# Altium schematic sheet prijemnik_sematik.SchDoc
size A3; SheetNumber: 1; SheetTotal: 1
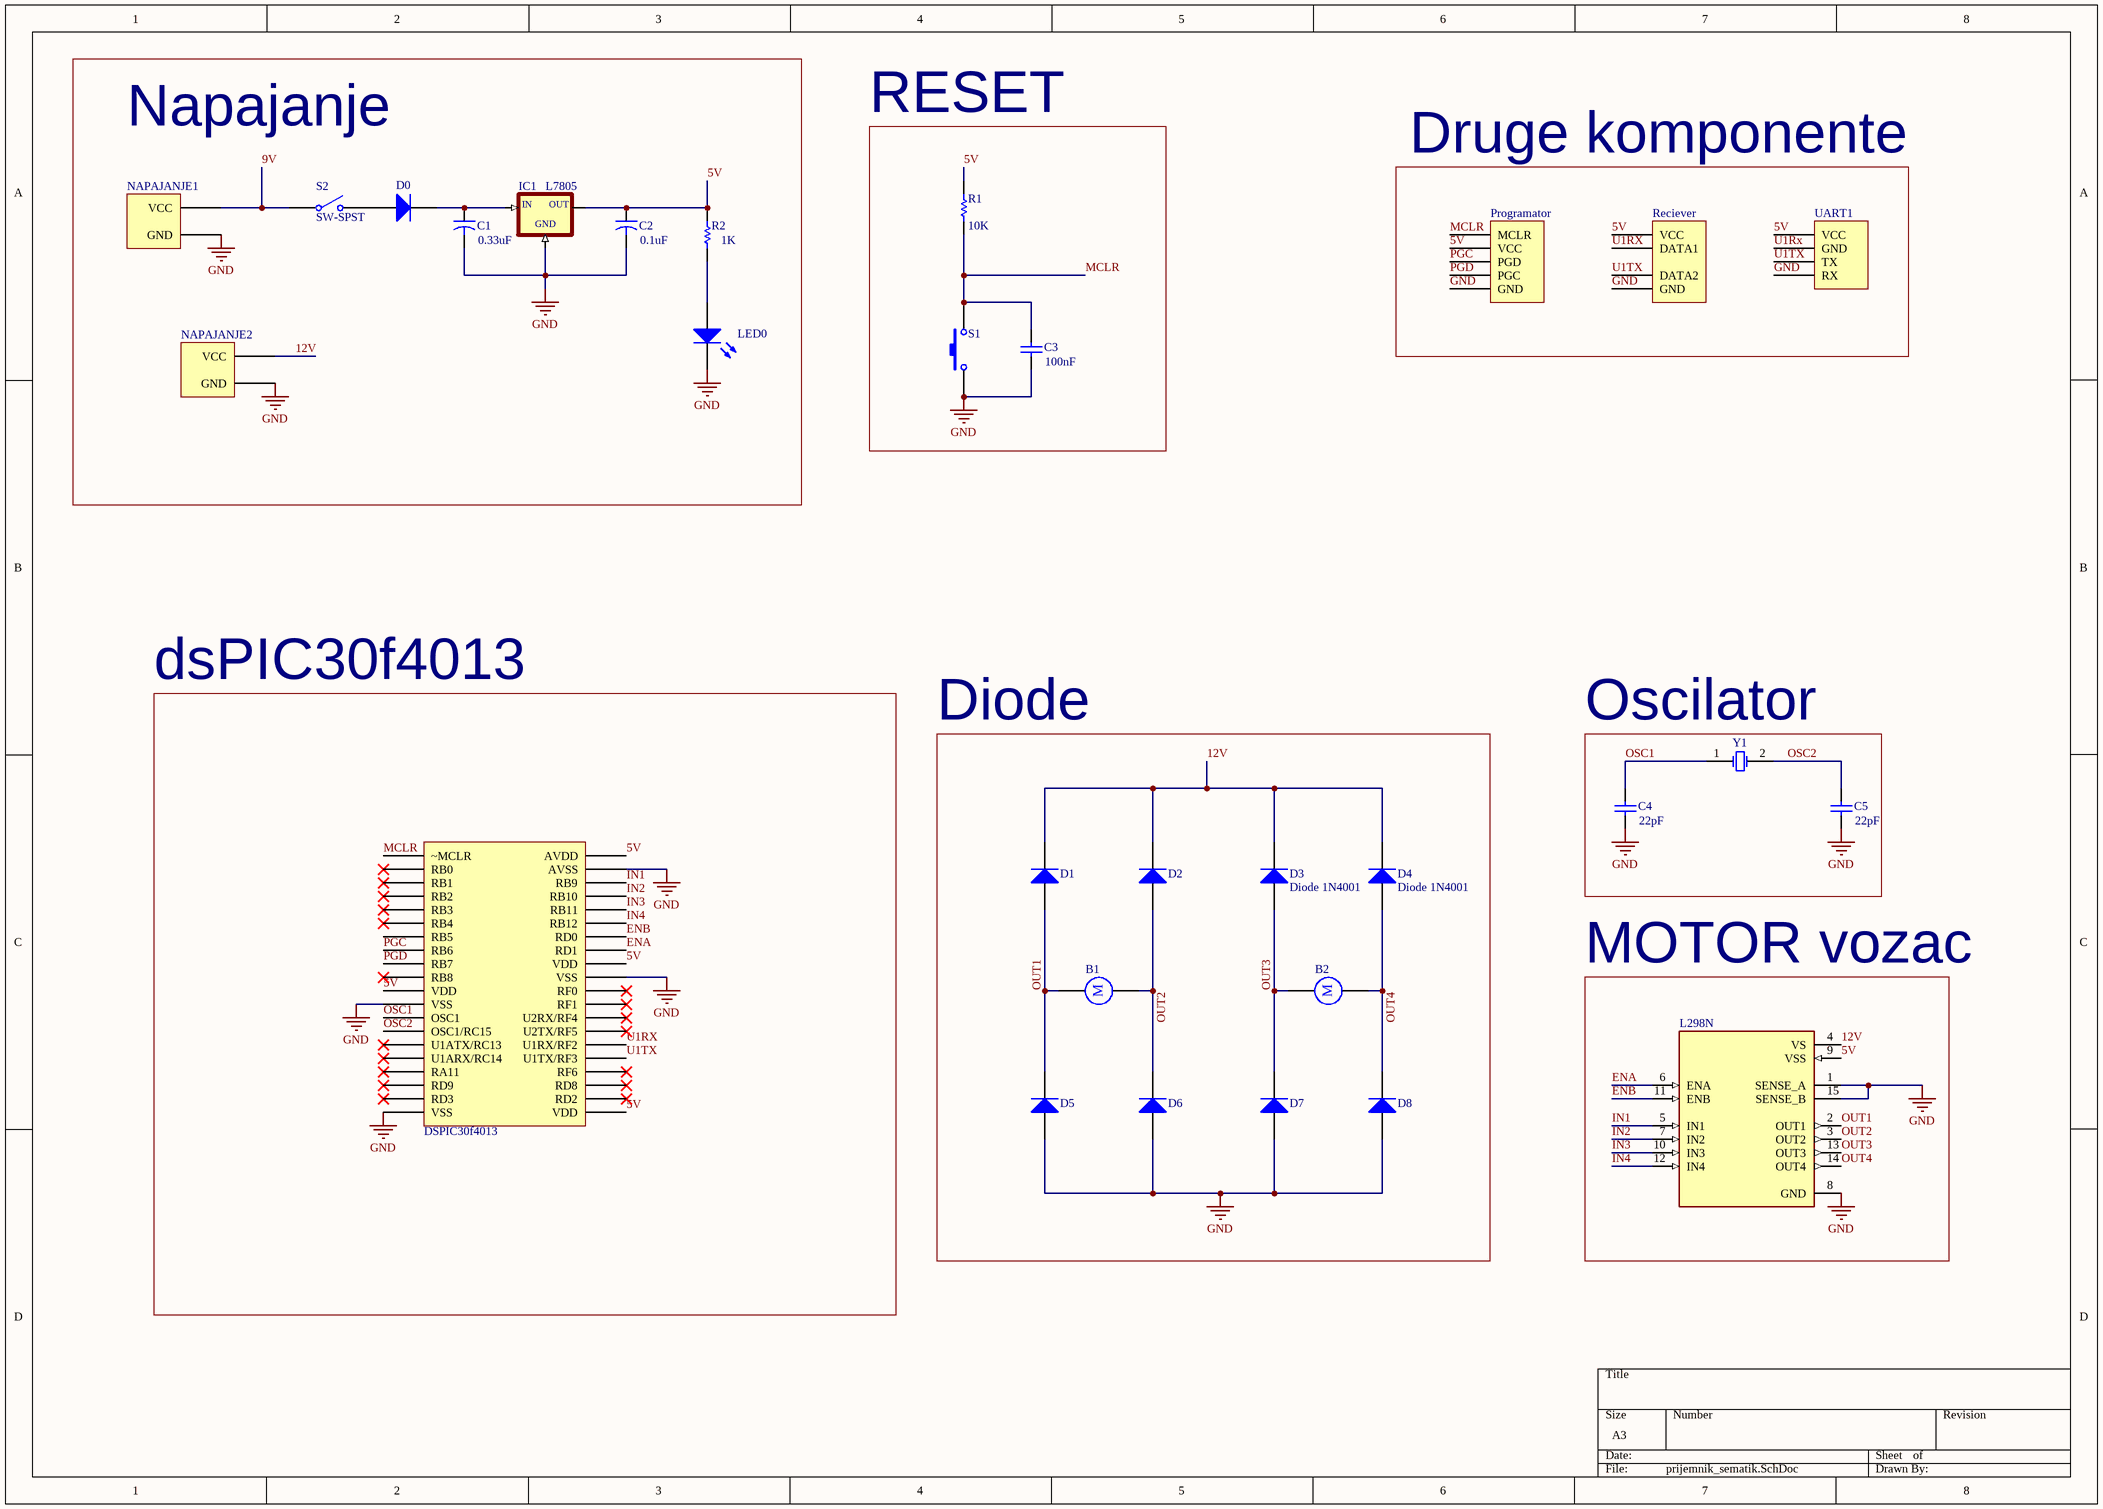
[diagram p0: prijemnik_sematik.SchDoc]

## Parts
B1  Motor  [RB5-10.5]  (value not drawn)
B2  Motor  [RB5-10.5]  (value not drawn)
C1  value 0.33uF  [CAPR5-4X5]  (hidden comment: Cap2)
C2  value 0.1uF  [CAPR5-4X5]  (hidden comment: Cap2)
C3  value 100nF  [RAD-0.3]  (hidden comment: Cap)
C4  value 22pF  [RAD-0.3]  (hidden comment: Cap)
C5  value 22pF  [RAD-0.3]  (hidden comment: Cap)
D0  Diode 1N4007  [DO-41]  (value not drawn)
D1  Diode 1N4001  [DO-41]  (value not drawn)
D2  Diode 1N4001  [DO-41]  (value not drawn)
D3  Diode 1N4001  [DO-41]
D4  Diode 1N4001  [DO-41]
D5  Diode 1N4001  [DO-41]  (value not drawn)
D6  Diode 1N4001  [DO-41]  (value not drawn)
D7  Diode 1N4001  [DO-41]  (value not drawn)
D8  Diode 1N4001  [DO-41]  (value not drawn)
DSPIC30f4013  DSPIC30f4013  [DIP254P1524X635-40]  (value not drawn)
IC1  L7805  [78XXS]
L298N  L298N  [TO127P2020X500X2100-15]  (value not drawn)
LED0  LED0  [LED-0]  (value not drawn)
NAPAJANJE1  NAPAJANJE  [HDR1X2]  (value not drawn)
NAPAJANJE2  NAPAJANJE  [HDR1X2]  (value not drawn)
Programator  Programator  [HDR1X5]  (value not drawn)
R1  value 10K  [AXIAL-0.3]  (hidden comment: Res1)
R2  value 1K  [AXIAL-0.3]  (hidden comment: Res1)
Reciever  Reciever  [HDR1X4]  (value not drawn)
S1  SW-PB  [SPST-2]  (value not drawn)
S2  SW-SPST  [SPST-2]
UART1  UART1  [HDR1X4]  (value not drawn)
Y1  XTAL  [R38]  (value not drawn)

## Blocks framed on the sheet
Napajanje: C1 C2 D0 IC1 LED0 NAPAJANJE1 NAPAJANJE2 R2 S2
RESET: C3 R1 S1
Druge komponente: Programator Reciever UART1
dsPIC30f4013: DSPIC30f4013
Diode: B1 B2 D1-D8
Oscilator: C4 C5 Y1
MOTOR vozac: L298N

## Nets
GND: C1.2 C2.2 C3.1 C4.1 C5.1 D5.1(A) D6.1(A) D7.1(A) D8.1(A) DSPIC30f4013.12(VSS) DSPIC30f4013.20(VSS) DSPIC30f4013.31(VSS) DSPIC30f4013.39(AVSS) IC1.GND L298N.1(SENSE_A) L298N.8(GND) L298N.15(SENSE_B) LED0.2(K) NAPAJANJE1.GND NAPAJANJE2.GND Programator.28(GND) Reciever.33(GND) S1.1 UART1.27(RX)
5V: C2.1 DSPIC30f4013.11(VDD) DSPIC30f4013.21(VDD) DSPIC30f4013.32(VDD) DSPIC30f4013.40(AVDD) IC1.OUT L298N.9(VSS) Programator.25(VCC) R1.2 R2.2 Reciever.30(VCC) UART1.24(VCC)
9V: NAPAJANJE1.VCC S2.1(COMMON)
12V: D1.2(K) D2.2(K) D3.2(K) D4.2(K) L298N.4(VS) NAPAJANJE2.VCC
ENA: DSPIC30f4013.33(RD1) L298N.6(ENA)
ENB: DSPIC30f4013.34(RD0) L298N.11(ENB)
IN1: DSPIC30f4013.38(RB9) L298N.5(IN1)
IN2: DSPIC30f4013.37(RB10) L298N.7(IN2)
IN3: DSPIC30f4013.36(RB11) L298N.10(IN3)
IN4: DSPIC30f4013.35(RB12) L298N.12(IN4)
MCLR: C3.2 DSPIC30f4013.1(~MCLR) Programator.24(MCLR) R1.1 S1.2
OSC1: C4.2 DSPIC30f4013.13(OSC1) Y1.1(OSC1)
OSC2: C5.2 DSPIC30f4013.14(OSC1/RC15) Y1.2(OSC2)
OUT1: B1.1 D1.1(A) D5.2(K) L298N.2(OUT1)
OUT2: B1.2 D2.1(A) D6.2(K) L298N.3(OUT2)
OUT3: B2.1 D3.1(A) D7.2(K) L298N.13(OUT3)
OUT4: B2.2 D4.1(A) D8.2(K) L298N.14(OUT4)
PGC: DSPIC30f4013.8(RB6) Programator.26(PGD)
PGD: DSPIC30f4013.9(RB7) Programator.27(PGC)
U1RX: DSPIC30f4013.26(U1RX/RF2) Reciever.31(DATA1) UART1.25(GND)
U1TX: DSPIC30f4013.25(U1TX/RF3) Reciever.32(DATA2) UART1.26(TX)
NetC1_1: C1.1 D0.2(K) IC1.IN
NetD0_1: D0.1(A) S2.2(NO)
NetLED0_1: LED0.1(A) R2.1

Not connected (* = marked no-connect by the designer): DSPIC30f4013 2(RB0)* 3(RB1)* 4(RB2)* 5(RB3)* 6(RB4)* 7(RB5) 10(RB8)* 15(U1ATX/RC13)* 16(U1ARX/RC14)* 17(RA11)* 18(RD9)* 19(RD3)* 22(RD2)* 23(RD8)* 24(RF6)* 27(U2TX/RF5)* 28(U2RX/RF4)* 29(RF1)* 30(RF0)*

## Notes on the sheet
- (in symbol Motor) M

## Library data of the parts
B1 B2 = Motor: Motor, General Kind; Published: 24-Mar-1999; LatestRevisionDate: 17-Jul-2002; LatestRevisionNote: Re-released for DXP Platform.; PackageReference: RB5-10.5; Publisher: Altium Limited; PackageDescription: Capacitor (Radial); 2 Leads
C1 C2 = Cap2: Capacitor; Published: 23-Sep-2002; PackageReference: CAPR5-4X5; Publisher: Altium Limited; PackageDescription: Capacitor; 2 Leads
C3-C5 = Cap: Capacitor; Published: 8-Jun-2000; LatestRevisionDate: 17-Jul-2002; LatestRevisionNote: Re-released for DXP Platform.; PackageReference: RAD-0.3; Publisher: Altium Limited; PackageDescription: Radial Cap, Thru-Hole; 2 Leads; 0.3 in Pin Spacing
D0 = Diode 1N4007: 1 Amp General Purpose Rectifier; Published: 8-Jun-2000; LatestRevisionDate: 17-Jul-2002; LatestRevisionNote: Re-released for DXP Platform.; DatasheetVersion: 1998; PackageVersion: Aug-1999; PackageReference: DO-41; Publisher: Altium Limited; PackageDescription: Diode, Axial; Body 5.2 x 2.7 mm (LxDia. max), Lead Dia. 0.86 mm (max); Code_JEDEC: DO-204-AL; ComponentLink1Description: Manufacturer Link; ComponentLink1URL: http://www.fairchildsemi.com/; ComponentLink2Description: Datasheet; ComponentLink2URL: http://www.fairchildsemi.com/ds/1N%2F1N4001.pdf
D1-D8 = Diode 1N4001: 1 Amp General Purpose Rectifier; Published: 8-Jun-2000; LatestRevisionDate: 17-Jul-2002; LatestRevisionNote: Re-released for DXP Platform.; DatasheetVersion: 1998; PackageVersion: Aug-1999; PackageReference: DO-41; Publisher: Altium Limited; PackageDescription: Diode, Axial; Body 5.2 x 2.7 mm (LxDia. max), Lead Dia. 0.86 mm (max); Code_JEDEC: DO-204-AL; ComponentLink1Description: Manufacturer Link; ComponentLink1URL: http://www.fairchildsemi.com/; ComponentLink2Description: Datasheet; ComponentLink2URL: http://www.fairchildsemi.com/ds/1N%2F1N4001.pdf
IC1 = L7805: Linear Voltage Regulator IC 1 Output 1.5A D2PAK; MF: STMicroelectronics; Package: TO-263-3 Inchange Semiconductor; Availability: Unavailable; MP: L7805; Value: *; SnapEDA_Link: https://www.snapeda.com/parts/L7805/STMicroelectronics/view-part/563125/?ref=snap; Price: None
L298N = L298N: Half Bridge _4_ Driver DC Motors, Relays, Solenoids, Stepper Motors Bipolar 15-Multiwatt; MF: STMicroelectronics; MP: L298N; Package: Multiwatt-15 STMicroelectronics; Price: None; Availability: Unavailable; Value: *; SnapEDA_Link: https://www.snapeda.com/parts/L298N/STMicroelectronics/view-part/294022/?ref=snap
LED0 = LED0: Typical INFRARED GaAs LED; Published: 8-Jun-2000; LatestRevisionDate: 08-Jul-2005; LatestRevisionNote: Mech Layer 1 removed.; PackageReference: LED-0; Publisher: Altium Limited; PackageDescription: LED; 2 Leads
NAPAJANJE1 NAPAJANJE2 = NAPAJANJE: pin to pad: GND>2 VCC>1
Programator = Programator: pin to pad: 24>1 25>2 26>3 27>4 28>5
R1 R2 = Res1: Resistor; Published: 8-Jun-2000; LatestRevisionDate: 17-Jul-2002; LatestRevisionNote: Re-released for DXP Platform.; PackageReference: AXIAL-0.3; Publisher: Altium Limited; PackageDescription: Axial Device, Thru-Hole; 2 Leads; 0.3 in Pin Spacing
Reciever = Reciever: pin to pad: 30>1 31>2 32>3 33>4
S1 = SW-PB: Switch; Published: 24-Mar-1999; LatestRevisionDate: 17-Jul-2002; LatestRevisionNote: Re-released for DXP Platform.; PackageReference: SPST-2; Publisher: Altium Limited; PackageDescription: Switch; 2 Leads
S2 = SW-SPST: Single-Pole, Single-Throw Switch; Published: 24-Mar-1999; LatestRevisionDate: 17-Jul-2002; LatestRevisionNote: Re-released for DXP Platform.; PackageReference: SPST-2; Publisher: Altium Limited; PackageDescription: Switch; 2 Leads
UART1 = UART1: pin to pad: 24>1 25>2 26>3 27>4
Y1 = XTAL: Crystal Oscillator; Published: 8-Jun-2000; LatestRevisionDate: 17-Jul-2002; LatestRevisionNote: Re-released for DXP Platform.; PackageReference: R38; Publisher: Altium Limited; PackageDescription: Crystal, Thru-Hole; 2 Leads; Body 3.1 x 8.2 mm (Dia.xH)